# Altium project 128x64液晶接线模块.PRJPCB
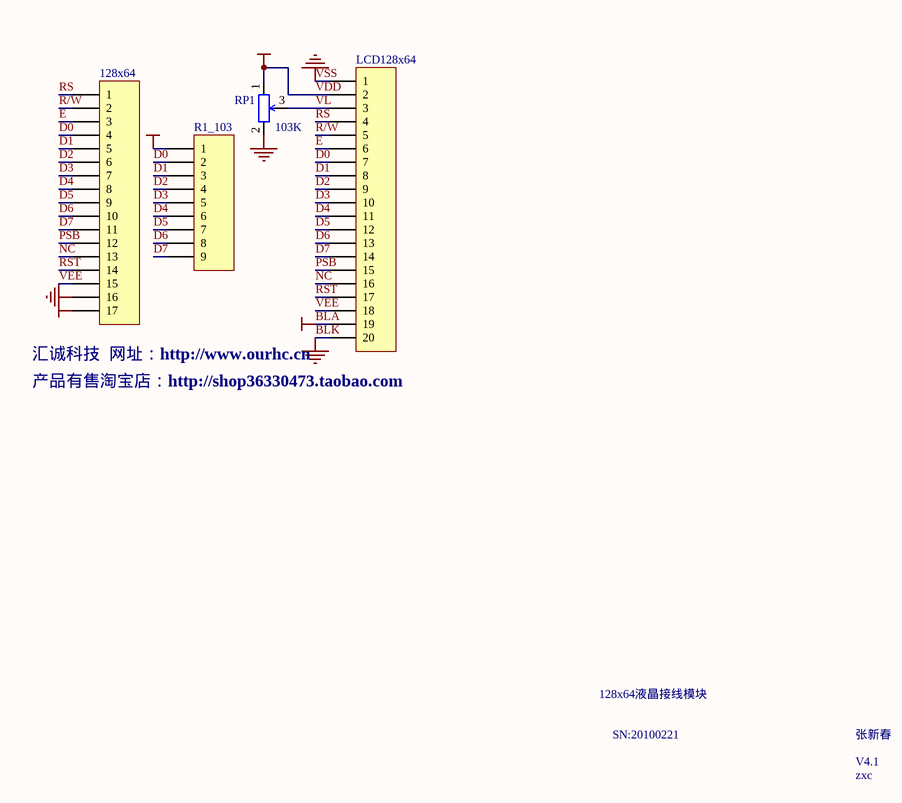
[diagram p0: 128x64液晶接线模块.SCHDOC]
1 sheet, 4 parts. Net scope: global (net labels, ports and power ports of the same name join across sheets).
Board file: 128x64液晶接线模块.PCBDOC

## Sheet 128x64液晶接线模块.SCHDOC
size A4

### Parts
128x64  Header 17  [HDR1X17]  (value not drawn)
LCD128x64  Header 20  [HDR1X20]  (value not drawn)
R1_103  Header 9  [HDR1X9]  (value not drawn)
RP1  value 103K  [SIP3-D]  (hidden comment: Res _JT)

### Nets
BLA: 128x64.17 LCD128x64.2 LCD128x64.19 R1_103.1 RP1.1  [also labelled VCC, VDD]
BLK: 128x64.16 LCD128x64.1 LCD128x64.20 RP1.2  [also labelled GND, VSS]
D0: 128x64.4 LCD128x64.7 R1_103.2
D1: 128x64.5 LCD128x64.8 R1_103.3
D2: 128x64.6 LCD128x64.9 R1_103.4
D3: 128x64.7 LCD128x64.10 R1_103.5
D4: 128x64.8 LCD128x64.11 R1_103.6
D5: 128x64.9 LCD128x64.12 R1_103.7
D6: 128x64.10 LCD128x64.13 R1_103.8
D7: 128x64.11 LCD128x64.14 R1_103.9
E: 128x64.3 LCD128x64.6
NC: 128x64.13 LCD128x64.16
PSB: 128x64.12 LCD128x64.15
R/W: 128x64.2 LCD128x64.5
RS: 128x64.1 LCD128x64.4
RST: 128x64.14 LCD128x64.17
VEE: 128x64.15 LCD128x64.18
VL: LCD128x64.3 RP1.3

### Notes on the sheet
- (near 128x64) 汇诚科技  网址：http://www.ourhc.cn
- (near LCD128x64) 产品有售淘宝店：http://shop36330473.taobao.com
- 128x64液晶接线模块
- SN:20100221
- 张新春
- V4.1
- zxc

### Library data of the parts
128x64 = Header 17: Header, 17-Pin; LatestRevisionDate: 17-Jul-2002; LatestRevisionNote: Re-released for DXP Platform.; Publisher: Altium Limited
LCD128x64 = Header 20: Header, 20-Pin; LatestRevisionDate: 17-Jul-2002; LatestRevisionNote: Re-released for DXP Platform.; Publisher: Altium Limited
R1_103 = Header 9: Header, 9-Pin; LatestRevisionDate: 17-Jul-2002; LatestRevisionNote: Re-released for DXP Platform.; Publisher: Altium Limited
RP1 = Res _JT: j精调电阻; Set Position: 0.5; Published: 8-Jun-2000; LatestRevisionDate: 17-Jul-2002; LatestRevisionNote: Re-released for DXP Platform.; Publisher: Altium Limited